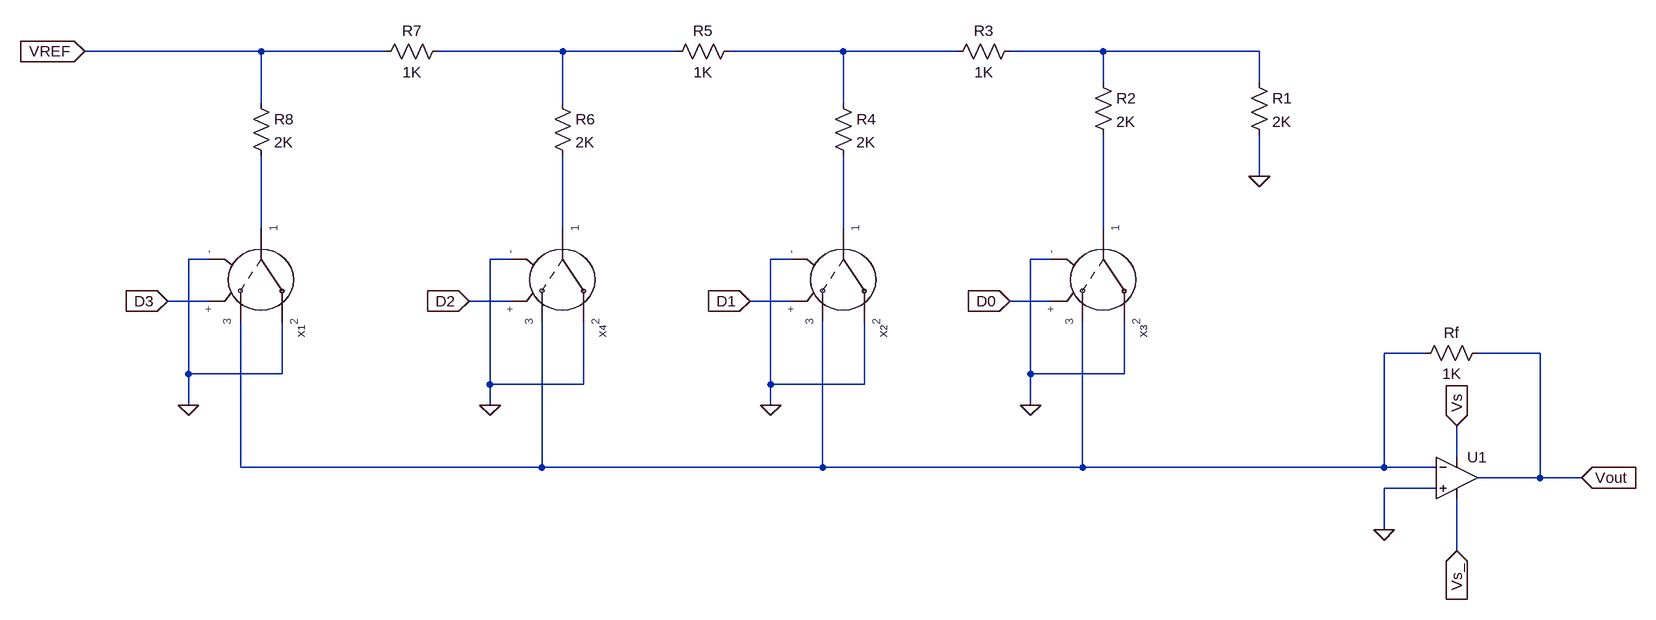
[diagram p0: schematic q1.asc]
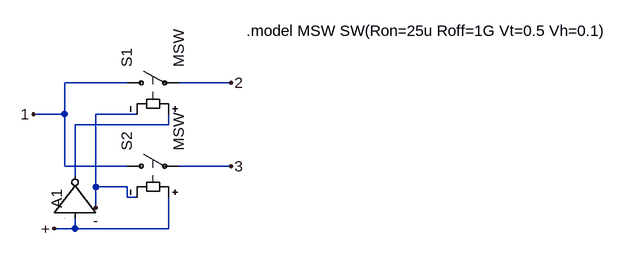
[diagram p1: sub-circuit spdt.asc]
q1.asc, the LTspice schematic file:
Version 4
SHEET 1 2352 1016
WIRE 208 -176 -64 -176
WIRE 400 -176 208 -176
WIRE 672 -176 480 -176
WIRE 848 -176 672 -176
WIRE 1104 -176 928 -176
WIRE 1280 -176 1104 -176
WIRE 1504 -176 1360 -176
WIRE 1744 -176 1504 -176
WIRE 1504 -128 1504 -176
WIRE 1744 -128 1744 -176
WIRE 208 -96 208 -176
WIRE 672 -96 672 -176
WIRE 1104 -96 1104 -176
WIRE 1744 16 1744 -48
WIRE 208 96 208 -16
WIRE 672 96 672 -16
WIRE 1104 96 1104 -16
WIRE 1504 96 1504 -48
WIRE 128 144 96 144
WIRE 592 144 560 144
WIRE 1024 144 992 144
WIRE 1424 144 1392 144
WIRE 128 208 64 208
WIRE 592 208 528 208
WIRE 1024 208 960 208
WIRE 1424 208 1360 208
WIRE 2000 288 1936 288
WIRE 2176 288 2080 288
WIRE 96 320 96 144
WIRE 240 320 240 240
WIRE 240 320 96 320
WIRE 1392 320 1392 144
WIRE 1536 320 1536 240
WIRE 1536 320 1392 320
WIRE 560 336 560 144
WIRE 704 336 704 240
WIRE 704 336 560 336
WIRE 992 336 992 144
WIRE 1136 336 1136 240
WIRE 1136 336 992 336
WIRE 96 368 96 320
WIRE 560 368 560 336
WIRE 992 368 992 336
WIRE 1392 368 1392 320
WIRE 2048 448 2048 400
WIRE 176 464 176 240
WIRE 640 464 640 240
WIRE 640 464 176 464
WIRE 1072 464 1072 240
WIRE 1072 464 640 464
WIRE 1472 464 1472 240
WIRE 1472 464 1072 464
WIRE 1936 464 1936 288
WIRE 1936 464 1472 464
WIRE 2016 464 1936 464
WIRE 2176 480 2176 288
WIRE 2176 480 2080 480
WIRE 2240 480 2176 480
WIRE 2016 496 1936 496
WIRE 1936 560 1936 496
WIRE 2048 592 2048 512
FLAG 96 368 0
FLAG 64 208 D3
IOPIN 64 208 In
FLAG 1392 368 0
FLAG 1360 208 D0
IOPIN 1360 208 In
FLAG 992 368 0
FLAG 960 208 D1
IOPIN 960 208 In
FLAG 560 368 0
FLAG 528 208 D2
IOPIN 528 208 In
FLAG 1744 16 0
FLAG -64 -176 VREF
IOPIN -64 -176 In
FLAG 2240 480 Vout
IOPIN 2240 480 In
FLAG 1936 560 0
FLAG 2048 400 Vs
IOPIN 2048 400 In
FLAG 2048 592 Vs_
IOPIN 2048 592 In
SYMBOL SPDT 208 144 R90
SYMATTR InstName X1
SYMBOL SPDT 1504 144 R90
SYMATTR InstName X3
SYMBOL SPDT 1104 144 R90
SYMATTR InstName X2
SYMBOL SPDT 672 144 R90
SYMATTR InstName X4
SYMBOL res 1728 -144 R0
SYMATTR InstName R1
SYMATTR Value 2K
SYMBOL res 1488 -144 R0
SYMATTR InstName R2
SYMATTR Value 2K
SYMBOL res 1088 -112 R0
SYMATTR InstName R4
SYMATTR Value 2K
SYMBOL res 656 -112 R0
SYMATTR InstName R6
SYMATTR Value 2K
SYMBOL res 192 -112 R0
SYMATTR InstName R8
SYMATTR Value 2K
SYMBOL res 1376 -192 R90
WINDOW 0 0 56 VBottom 2
WINDOW 3 32 56 VTop 2
SYMATTR InstName R3
SYMATTR Value 1K
SYMBOL res 944 -192 R90
WINDOW 0 0 56 VBottom 2
WINDOW 3 32 56 VTop 2
SYMATTR InstName R5
SYMATTR Value 1K
SYMBOL res 496 -192 R90
WINDOW 0 0 56 VBottom 2
WINDOW 3 32 56 VTop 2
SYMATTR InstName R7
SYMATTR Value 1K
SYMBOL res 2096 272 R90
WINDOW 0 0 56 VBottom 2
WINDOW 3 32 56 VTop 2
SYMATTR InstName Rf
SYMATTR Value 1K
SYMBOL OpAmps\\UniversalOpAmp 2048 480 R0
SYMATTR InstName U1

spdt.asc, the sub-circuit schematic file:
Version 4
SHEET 1 932 680
WIRE 144 96 48 96
WIRE 304 96 224 96
WIRE 48 144 48 96
WIRE 48 144 0 144
WIRE 160 144 96 144
WIRE 208 160 208 144
WIRE 208 160 64 160
WIRE 48 224 48 144
WIRE 144 224 48 224
WIRE 304 224 224 224
WIRE 64 240 64 160
WIRE 96 256 96 144
WIRE 144 256 96 256
WIRE 144 272 144 256
WIRE 160 272 144 272
WIRE 96 288 96 256
WIRE 64 320 64 304
WIRE 64 320 32 320
WIRE 208 320 208 272
WIRE 208 320 64 320
FLAG 0 144 1
FLAG 304 96 2
FLAG 304 224 3
FLAG 32 320 +
FLAG 96 288 -
SYMBOL sw 128 96 R270
SYMATTR InstName S1
SYMATTR Value MSW
SYMBOL sw 128 224 R270
SYMATTR InstName S2
SYMATTR Value MSW
SYMBOL Digital\\inv 128 304 M270
WINDOW 3 8 60 Invisible 2
WINDOW 0 15 92 Left 2
SYMATTR Value td=10n Vhigh=5
SYMATTR InstName A1
TEXT 328 16 Left 2 !.model MSW SW(Ron=25u Roff=1G Vt=0.5 Vh=0.1)

The netlist it stands for:
* q1.asc
XX1 N004 0 N008 D3 0 spdt
XX3 N007 0 N008 D0 0 spdt
XX2 N006 0 N008 D1 0 spdt
XX4 N005 0 N008 D2 0 spdt
R1 N003 0 2K
R2 N003 N007 2K
R4 N002 N006 2K
R6 N001 N005 2K
R8 VREF N004 2K
R3 N003 N002 1K
R5 N002 N001 1K
R7 N001 VREF 1K
Rf Vout N008 1K
XU1 0 N008 Vs Vs_ Vout level1 Avol=1Meg GBW=10Meg Vos=0 En=0 Enk=0 In=0 Ink=0 Rin=500Meg  ; pins In+ In- V+ V- OUT

* block symbol definitions
.subckt spdt 1 2 3 + -
S1 1 2 N001 - MSW
S2 1 3 + - MSW
A1 + 0 0 0 0 N001 0 0 BUF td=10n Vhigh=5
.model MSW SW(Ron=25u Roff=1G Vt=0.5 Vh=0.1)
.ends spdt

.lib UniversalOpAmp1.lib
.backanno
.end